# EAGLE design ball_catch_unit_back (EAGLE 9.6.2)
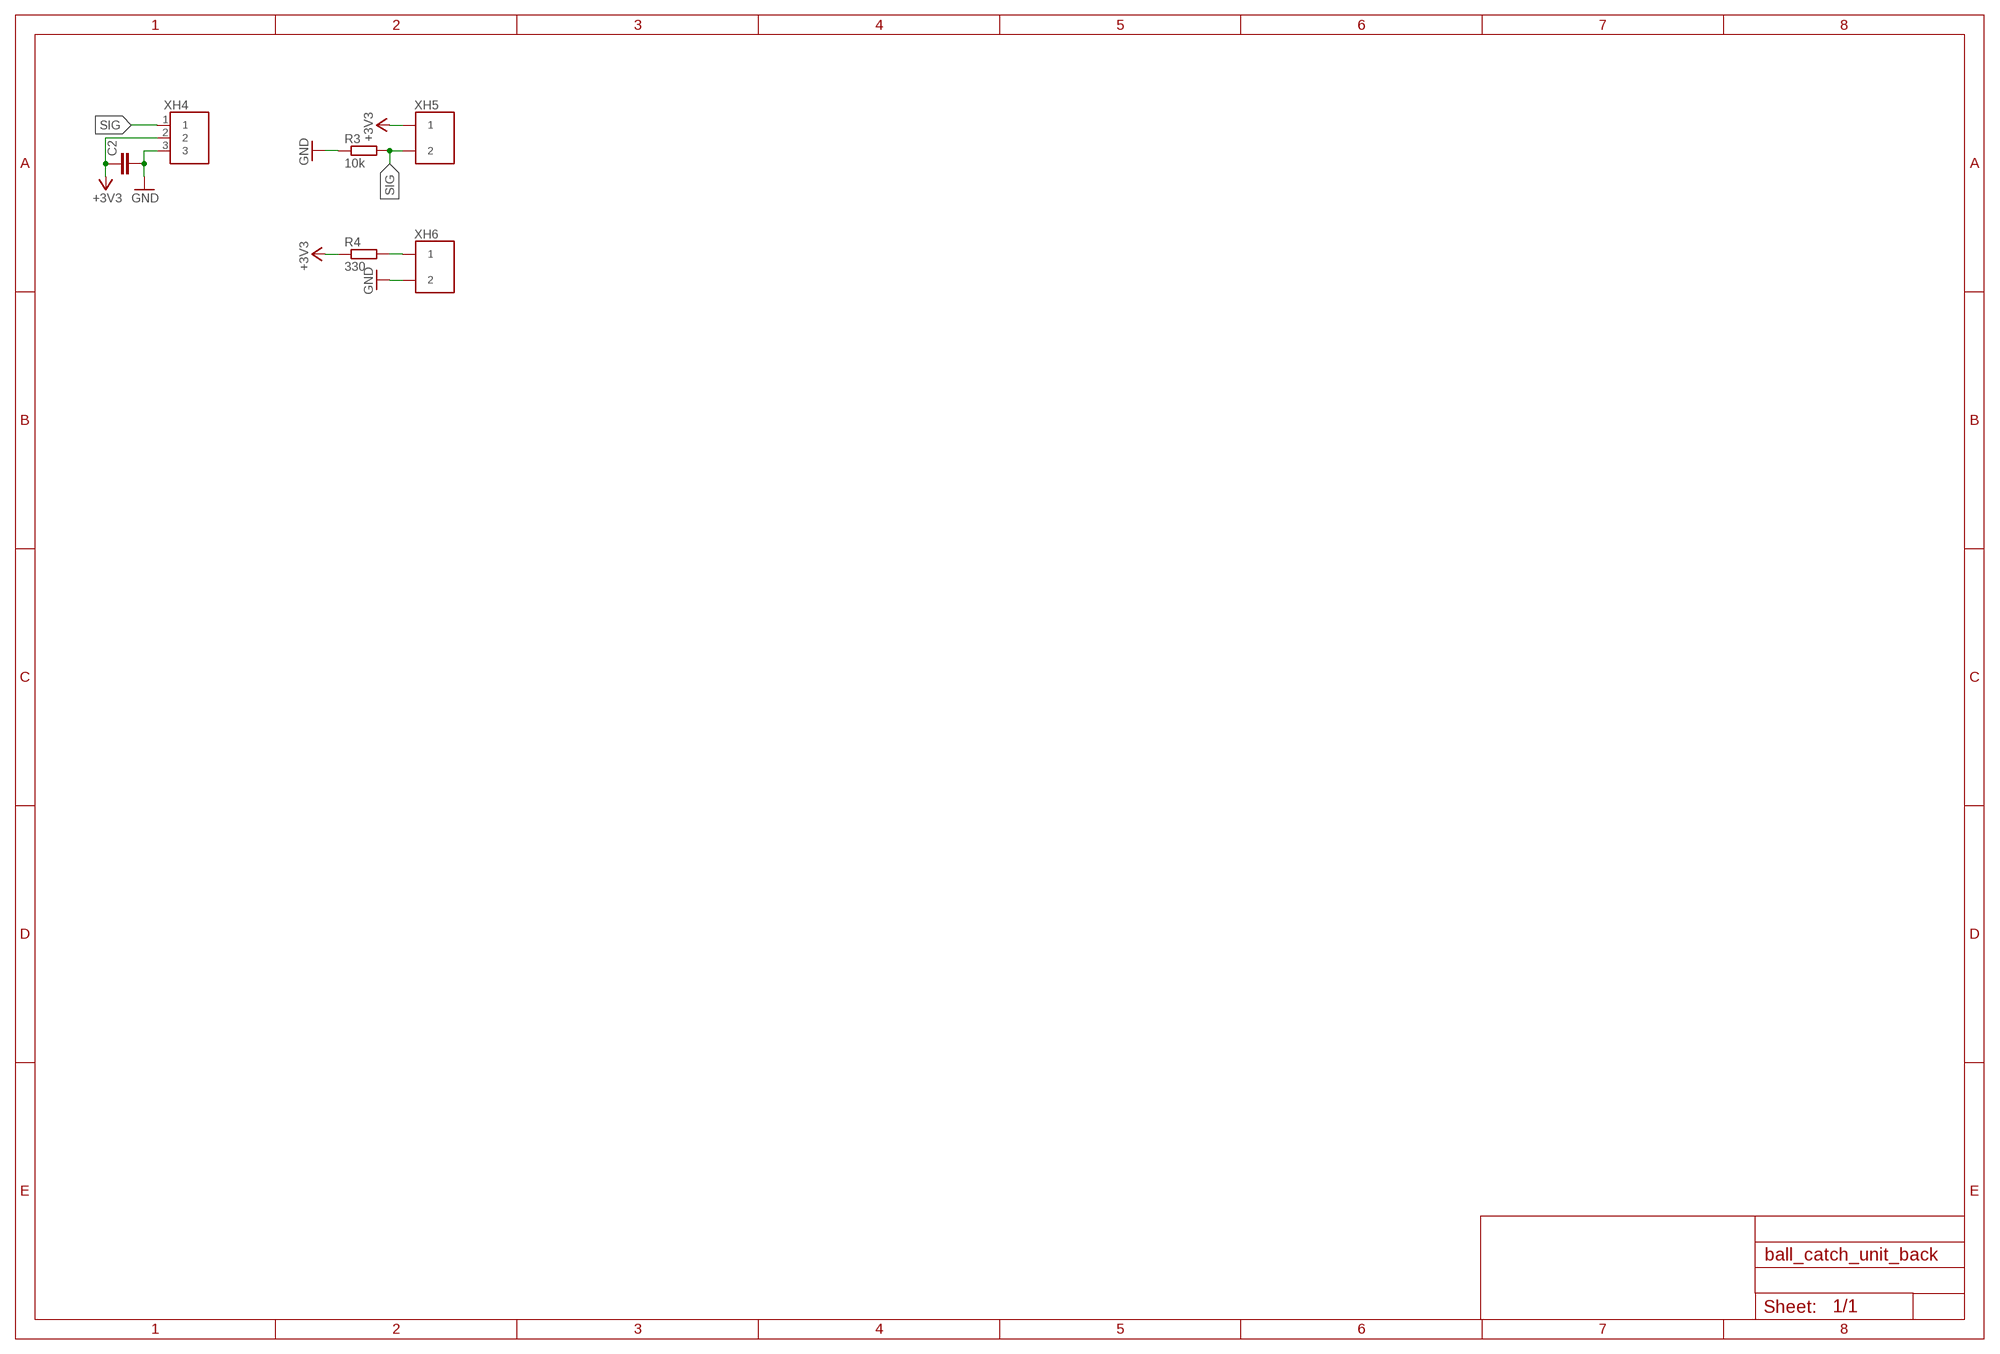
[diagram p0: schematic, sheet 1]

## Parts
C2  C-EUC0603  [C0603]
R3  10k  R-EU_0204/7  [0204/7]
R4  330  R-EU_0204/7  [0204/7]
XH4  S3B  [S3B]
XH5  2B  [2B]
XH6  S2B  [S2B]

## Nets
+3V3: C2.1 R4.1 XH4.2 XH5.1
GND: C2.2 R3.1 XH4.3 XH6.2
N$2: R4.2 XH6.1
SIG: R3.2 XH4.1 XH5.2

## Library data of the parts
C2 = rcl:C-EU: CAPACITOR, European symbol; SPICEPREFIX: C
R3 R4 = rcl:R-EU_: RESISTOR, European symbol; SPICEPREFIX: R
XH4 = XH:S3B
XH5 = XH:2B
XH6 = XH:S2B

## Board
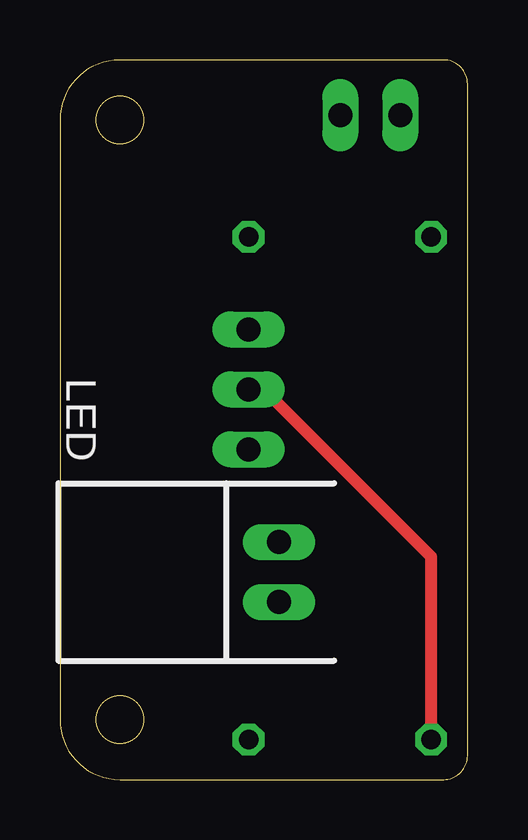
[diagram p1: board, top side]
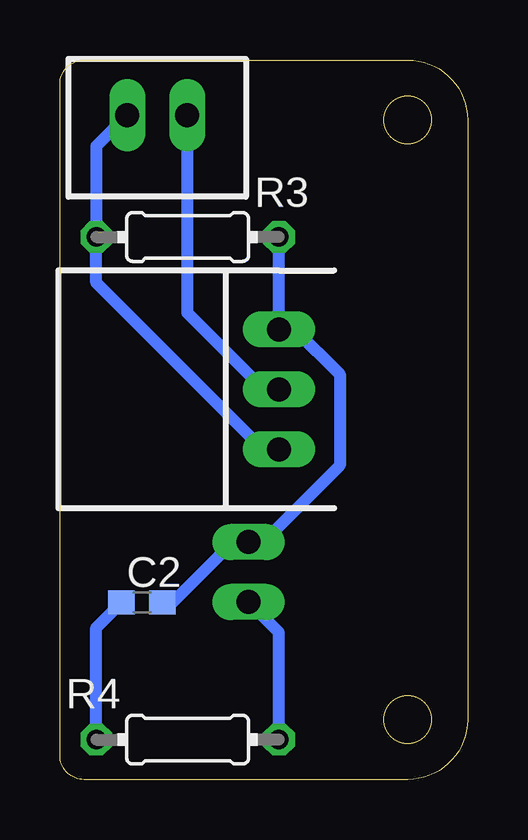
[diagram p2: board, bottom side, seen from below]

Size 17 x 30 mm. Coordinates in mm from the lower left corner, seen from the top.
Outline: 16,0 arc90 17,1 17,29 arc90 16,30 2.5,30 arc90 0,27.5 0,2.5 arc90 2.5,0 16,0
Outline: circle at 2.5,2.5 radius 1
Outline: circle at 2.5,27.5 radius 1
Copper layers (1*16): Top 0.035mm / dielectric 1.5mm / Bottom 0.035mm
Design rules "default *": minimum track width 6mil, minimum drill 0.35mm, track to track 6mil, track to pad 6mil, pad to pad 6mil, via to via 6mil, smd to smd 6mil, copper to edge 30mil, drill to drill 6mil, minimum pad ring 10mil, minimum via ring 8mil, stop-mask expansion 4mil, vias tented up to drill 0mil, thermal gap 10mil

### Footprints (pad centres in the part's own frame; a part is rotated, then mirrored left to right if it is on the bottom)
C0603 = smd 1.1 x 1: 1 -0.85,0; 2 0.85,0
0204/7 = drill 0.813 octagon: 1 -3.81,0; 2 3.81,0
S3B = drill 1 long: 1 0,2.5; 2 0,0; 3 0,-2.5
2B = drill 1 long: 1 0,1.25; 2 0,-1.25
S2B = drill 1 long: 1 0,1.25; 2 0,-1.25

### Placement (x,y rotation side)
C2  13.58,7.38 0 bottom
R3  11.68,22.62 180 bottom
R4  11.68,1.66 0 bottom
XH4  7.87,16.27 180 bottom
XH5  12.95,27.7 270 bottom
XH6  9.13,8.65 180 top

### Tracks (layer width: path | path; a pad name or v marks a point on that pad's centre or on a via)
+3V3
  Top 0.5: R4.1 15.48,9.29 8.5,16.27 XH4.2
  Bottom 0.5: XH5.1 11.7,19.46 8.5,16.27 XH4.2 | R4.1 15.48,6.32 C2.1
GND
  Bottom 0.5: R3.1 XH4.3 7.19,18.77 5.33,16.91 5.33,13.1 8.52,9.9 XH6.2 9.79,9.9 12.31,7.38 C2.2
N$2
  Bottom 0.5: R4.2 7.87,6.13 XH6.1
SIG
  Bottom 0.5: XH5.2 15.48,26.41 R3.2 15.48,20.71 8.54,13.77 XH4.1

### Text on the board
tPlace: LED